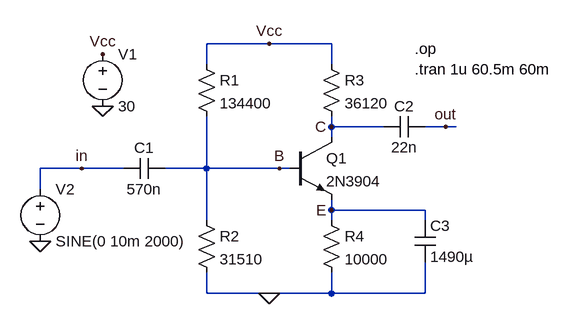
[diagram p0: schematic 4resistor.asc]
4resistor.asc, the LTspice schematic file:
Version 4
SHEET 1 880 680
WIRE 176 80 80 80
WIRE 272 80 176 80
WIRE 80 112 80 80
WIRE 272 112 272 80
WIRE 272 208 272 192
WIRE 352 208 272 208
WIRE 448 208 416 208
WIRE 464 208 448 208
WIRE 272 224 272 208
WIRE -112 272 -176 272
WIRE -48 272 -112 272
WIRE 80 272 80 192
WIRE 80 272 16 272
WIRE 192 272 80 272
WIRE 208 272 192 272
WIRE -176 304 -176 272
WIRE 272 336 272 320
WIRE 416 336 272 336
WIRE 80 352 80 272
WIRE 272 352 272 336
WIRE 416 352 416 336
WIRE 80 464 80 432
WIRE 176 464 80 464
WIRE 272 464 272 432
WIRE 272 464 176 464
WIRE 416 464 416 416
WIRE 416 464 272 464
FLAG -80 176 0
FLAG -80 96 Vcc
FLAG 176 80 Vcc
FLAG 176 464 0
FLAG 192 272 B
FLAG 272 336 E
FLAG 272 208 C
FLAG -176 384 0
FLAG 448 208 out
FLAG -112 272 in
SYMBOL voltage -80 80 R0
SYMATTR InstName V1
SYMATTR Value 30
SYMBOL Res 64 96 R0
SYMATTR InstName R1
SYMATTR Value 134400
SYMBOL Res 64 336 R0
SYMATTR InstName R2
SYMATTR Value 31510
SYMBOL Res 256 96 R0
SYMATTR InstName R3
SYMATTR Value 36120
SYMBOL Res 256 336 R0
SYMATTR InstName R4
SYMATTR Value 10000
SYMBOL npn 208 224 R0
SYMATTR InstName Q1
SYMATTR Value 2N3904
SYMBOL Cap -48 288 R270
WINDOW 0 32 32 VTop 2
WINDOW 3 0 32 VBottom 2
SYMATTR InstName C1
SYMATTR Value 570n
SYMBOL voltage -176 288 R0
SYMATTR InstName V2
SYMATTR Value SINE(0 10m 2000)
SYMBOL Cap 352 224 R270
WINDOW 0 32 32 VTop 2
WINDOW 3 0 32 VBottom 2
SYMATTR InstName C2
SYMATTR Value 22n
SYMBOL Cap 400 352 R0
SYMATTR InstName C3
SYMATTR Value 1490µ
TEXT 400 88 Left 2 !.op\n.tran 1u 60.5m 60m

The netlist it stands for:
* 4resistor.asc
V1 Vcc 0 30
R1 Vcc B 134400
R2 B 0 31510
R3 Vcc C 36120
R4 E 0 10000
Q1 C B E 0 2N3904
C1 in B 570n
V2 in 0 SINE(0 10m 2000)
C2 C out 22n
C3 E 0 1490µ
.model NPN NPN
.model PNP PNP
.lib standard.bjt
.op
.tran 1u 60.5m 60m
.backanno
.end